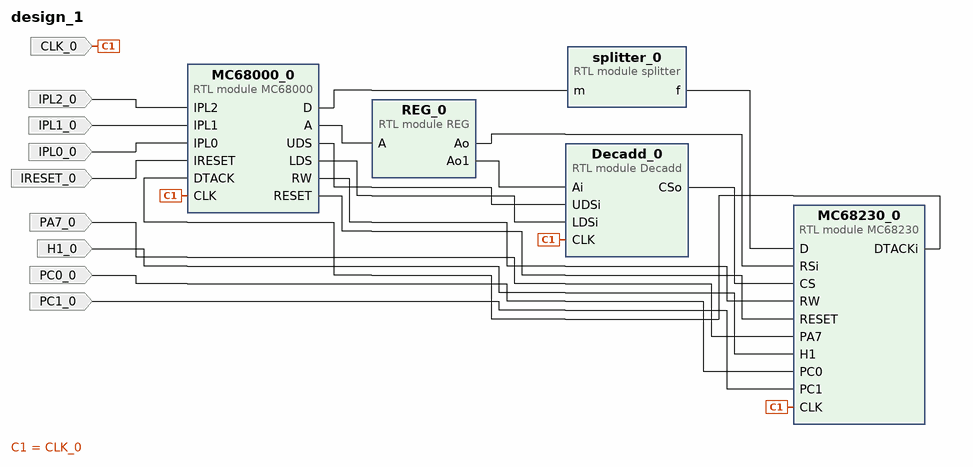
[diagram p0: block diagram of the top level]
# Vivado block design design_1, xc7a100tcsg324-1, Vivado 2020.1.1
create_bd_design design_1

create_bd_port -dir I IPL2_0
create_bd_port -dir I IPL1_0
create_bd_port -dir I IPL0_0
create_bd_port -dir I IRESET_0
create_bd_port -dir I -type clk CLK_0
create_bd_port -dir I PA7_0
create_bd_port -dir I H1_0
create_bd_port -dir I PC0_0
create_bd_port -dir I PC1_0

create_bd_cell -type module -reference REG REG_0
create_bd_cell -type module -reference MC68230 MC68230_0
create_bd_cell -type module -reference Decadd Decadd_0
create_bd_cell -type module -reference MC68000 MC68000_0
create_bd_cell -type module -reference splitter splitter_0

# ---- connections ----

connect_bd_net [get_bd_pins MC68000_0/D] [get_bd_pins splitter_0/m]
connect_bd_net [get_bd_pins REG_0/Ao1] [get_bd_pins Decadd_0/Ai]
connect_bd_net [get_bd_pins REG_0/Ao] [get_bd_pins MC68230_0/RSi]
connect_bd_net [get_bd_pins Decadd_0/CSo] [get_bd_pins MC68230_0/CS]
connect_bd_net [get_bd_pins MC68000_0/A] [get_bd_pins REG_0/A]
connect_bd_net [get_bd_pins MC68000_0/UDS] [get_bd_pins Decadd_0/UDSi]
connect_bd_net [get_bd_pins MC68000_0/RW] [get_bd_pins MC68230_0/RW]
connect_bd_net [get_bd_pins MC68000_0/RESET] [get_bd_pins MC68230_0/RESET]
connect_bd_net [get_bd_pins MC68000_0/LDS] [get_bd_pins Decadd_0/LDSi]
connect_bd_net -net IPL2_0_1 [get_bd_ports IPL2_0] [get_bd_pins MC68000_0/IPL2]
connect_bd_net -net IPL1_0_1 [get_bd_ports IPL1_0] [get_bd_pins MC68000_0/IPL1]
connect_bd_net -net IPL0_0_1 [get_bd_ports IPL0_0] [get_bd_pins MC68000_0/IPL0]
connect_bd_net -net IRESET_0_1 [get_bd_ports IRESET_0] [get_bd_pins MC68000_0/IRESET]
connect_bd_net -net CLK_0_1 [get_bd_ports CLK_0] [get_bd_pins MC68000_0/CLK] [get_bd_pins MC68230_0/CLK] [get_bd_pins Decadd_0/CLK]
connect_bd_net [get_bd_pins MC68230_0/DTACKi] [get_bd_pins MC68000_0/DTACK]
connect_bd_net [get_bd_pins splitter_0/f] [get_bd_pins MC68230_0/D]
connect_bd_net -net PA7_0_1 [get_bd_ports PA7_0] [get_bd_pins MC68230_0/PA7]
connect_bd_net -net H1_0_1 [get_bd_ports H1_0] [get_bd_pins MC68230_0/H1]
connect_bd_net -net PC0_0_1 [get_bd_ports PC0_0] [get_bd_pins MC68230_0/PC0]
connect_bd_net -net PC1_0_1 [get_bd_ports PC1_0] [get_bd_pins MC68230_0/PC1]

validate_bd_design
save_bd_design
